# Altium schematic sheet BumpSensors.SchDoc
size A; SheetNumber: roneV11-BumpSensors; SheetTotal: 6
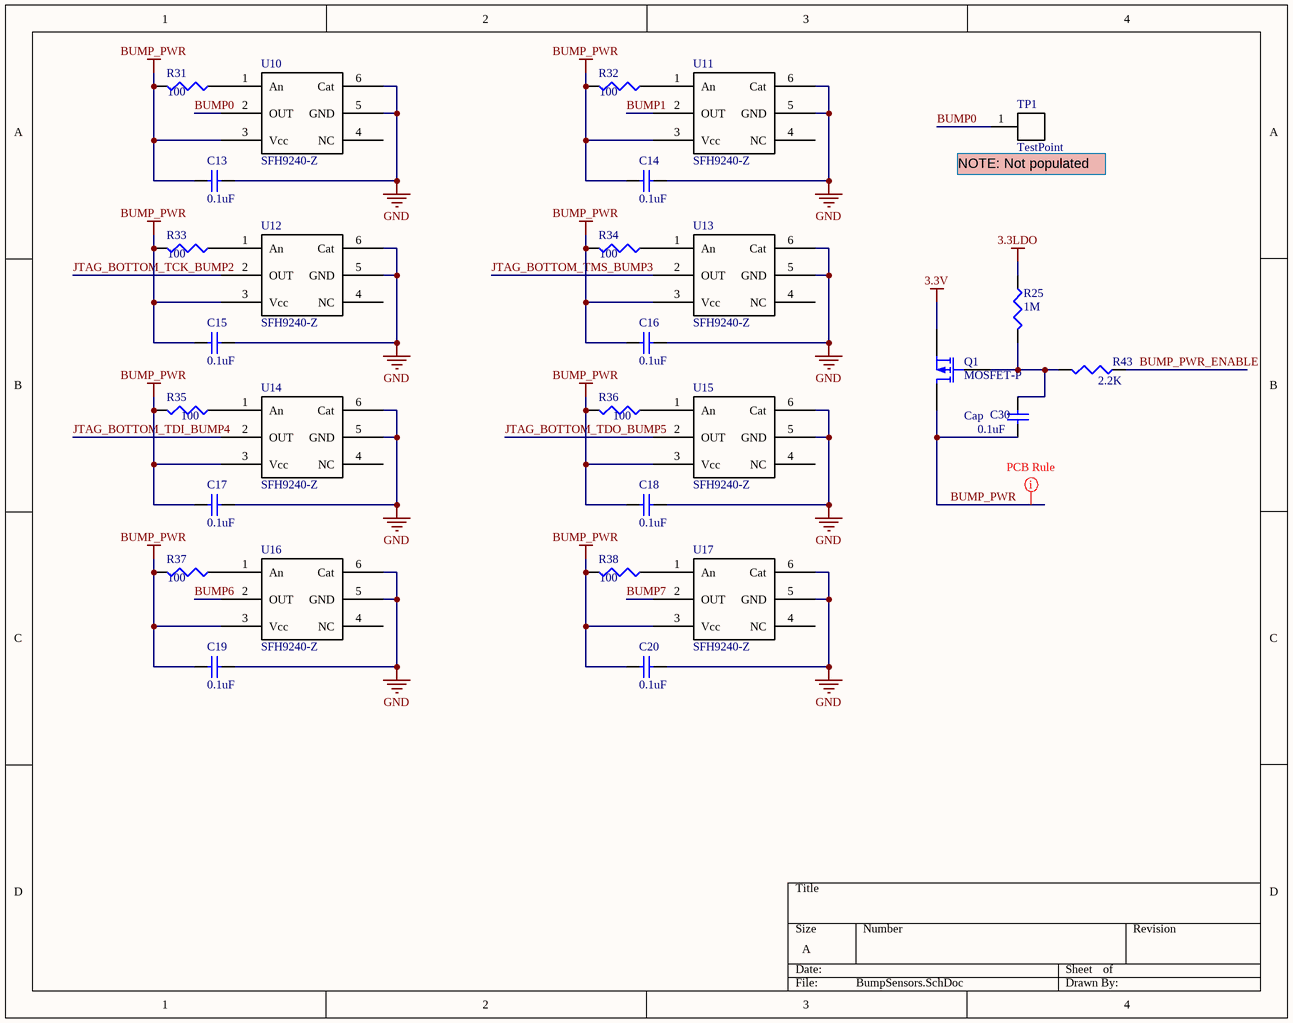
[diagram p0: BumpSensors.SchDoc]

## Parts
C13  value 0.1uF  [CAPC1005L]  (hidden comment: Cap Semi)
C14  value 0.1uF  [CAPC1005L]  (hidden comment: Cap Semi)
C15  value 0.1uF  [CAPC1005L]  (hidden comment: Cap Semi)
C16  value 0.1uF  [CAPC1005L]  (hidden comment: Cap Semi)
C17  value 0.1uF  [CAPC1005L]  (hidden comment: Cap Semi)
C18  value 0.1uF  [CAPC1005L]  (hidden comment: Cap Semi)
C19  value 0.1uF  [CAPC1005L]  (hidden comment: Cap Semi)
C20  value 0.1uF  [CAPC1005L]  (hidden comment: Cap Semi)
C30  Cap  value 0.1uF  [CAPC1005L]
Q1  MOSFET-P  [SOT-23]
R25  value 1M  [J1-0603]  (hidden comment: Res3)
R31  value 100  [RESC1608L]  (hidden comment: Res3)
R32  value 100  [RESC1608L]  (hidden comment: Res3)
R33  value 100  [RESC1608L]  (hidden comment: Res3)
R34  value 100  [RESC1608L]  (hidden comment: Res3)
R35  value 100  [RESC1608L]  (hidden comment: Res3)
R36  value 100  [RESC1608L]  (hidden comment: Res3)
R37  value 100  [RESC1608L]  (hidden comment: Res3)
R38  value 100  [RESC1608L]  (hidden comment: Res3)
R43  value 2.2K  [J1-0603]  (hidden comment: Res3)
TP1  TestPoint  [TestPoint]
U10  SFH9240-Z  [SFH9240-Z]
U11  SFH9240-Z  [SFH9240-Z]
U12  SFH9240-Z  [SFH9240-Z]
U13  SFH9240-Z  [SFH9240-Z]
U14  SFH9240-Z  [SFH9240-Z]
U15  SFH9240-Z  [SFH9240-Z]
U16  SFH9240-Z  [SFH9240-Z]
U17  SFH9240-Z  [SFH9240-Z]

## Nets
3.3LDO: R25.1
3.3V: Q1.2(S)
BUMP_PWR: C13.2 C14.2 C15.2 C16.2 C17.2 C18.2 C19.2 C20.2 C30.2 Q1.3(D) R31.2 R32.2 R33.2 R34.2 R35.2 R36.2 R37.2 R38.2 U10.3(Vcc) U11.3(Vcc) U12.3(Vcc) U13.3(Vcc) U14.3(Vcc) U15.3(Vcc) U16.3(Vcc) U17.3(Vcc)
GND: C13.1 C14.1 C15.1 C16.1 C17.1 C18.1 C19.1 C20.1 U10.5(GND) U10.6(Cat) U11.5(GND) U11.6(Cat) U12.5(GND) U12.6(Cat) U13.5(GND) U13.6(Cat) U14.5(GND) U14.6(Cat) U15.5(GND) U15.6(Cat) U16.5(GND) U16.6(Cat) U17.5(GND) U17.6(Cat)
BUMP0: TP1.1 U10.2(OUT)
BUMP1: U11.2(OUT)
BUMP6: U16.2(OUT)
BUMP7: U17.2(OUT)
BUMP_PWR_ENABLE: R43.1
JTAG_BOTTOM_TCK_BUMP2: U12.2(OUT)
JTAG_BOTTOM_TDI_BUMP4: U14.2(OUT)
JTAG_BOTTOM_TDO_BUMP5: U15.2(OUT)
JTAG_BOTTOM_TMS_BUMP3: U13.2(OUT)
NetC30_1: C30.1 Q1.1(G) R25.2 R43.2
NetR31_1: R31.1 U10.1(An)
NetR32_1: R32.1 U11.1(An)
NetR33_1: R33.1 U12.1(An)
NetR34_1: R34.1 U13.1(An)
NetR35_1: R35.1 U14.1(An)
NetR36_1: R36.1 U15.1(An)
NetR37_1: R37.1 U16.1(An)
NetR38_1: R38.1 U17.1(An)

Not connected (* = marked no-connect by the designer): U10 4(NC); U11 4(NC); U12 4(NC); U13 4(NC); U14 4(NC); U15 4(NC); U16 4(NC); U17 4(NC)

## Layout directives
rule Width Constraint [Pref Width = 15mil    Min Width = 10mil    Max Width = 15mil]: BUMP_PWR

## Notes on the sheet
- (near TP1) NOTE: Not populated

## Library data of the parts
C13-C20 = Cap Semi: Capacitor (Semiconductor SIM Model); Part Number: GRM155R71C104KA88D; Manufacturer: Murata; Published: 8-Jun-2000; LatestRevisionDate: 29-May-2009; LatestRevisionNote: IPC-7351 Footprint Added.; PackageReference: C1206; Publisher: Altium Limited; PackageDescription: Chip Capacitor
C30 = Cap: Capacitor; Part Number: GRM155R71C104KA88D; Manufacturer: Murata; Published: 8-Jun-2000; LatestRevisionDate: 17-Jul-2002; LatestRevisionNote: Re-released for DXP Platform.; PackageReference: RAD-0.3; Publisher: Altium Limited
Q1 = MOSFET-P: P-Channel MOSFET; Part Number: DMG2301U-7; Manufacturer: Diodes; Published: 8-Jun-2000; LatestRevisionDate: 17-Jul-2002; LatestRevisionNote: Re-released for DXP Platform.; PackageVersion: 1995/1996; PackageReference: E3; Publisher: Altium Limited
R25 = Res3: Resistor; Part Number: ERJ-3GEY-J105V; Manufacturer: Panasonic; Published: 8-Jun-2000; LatestRevisionDate: 29-May-2009; LatestRevisionNote: IPC-7351 Footprint Added.; PackageReference: J1-0603; Publisher: Altium Limited; PackageDescription: Chip Resistor
R31-R38 = Res3: Resistor; Part Number: ERJ-3GEYJ101V; Manufacturer: Panasonic; Published: 8-Jun-2000; LatestRevisionDate: 29-May-2009; LatestRevisionNote: IPC-7351 Footprint Added.; PackageReference: J1-0603; Publisher: Altium Limited; PackageDescription: Chip Resistor
R43 = Res3: Resistor; Part Number: ERJ-3GEYJ222V; Manufacturer: Panasonic; Published: 8-Jun-2000; LatestRevisionDate: 29-May-2009; LatestRevisionNote: IPC-7351 Footprint Added.; PackageReference: J1-0603; Publisher: Altium Limited; PackageDescription: Chip Resistor
U10-U17 = SFH9240-Z: Manufacturer: OSRAM; Part Number: SFH 9240-Z
TP1 = TestPoint: DNI: DNI